# Altium schematic sheet channel.SchDoc
size A4
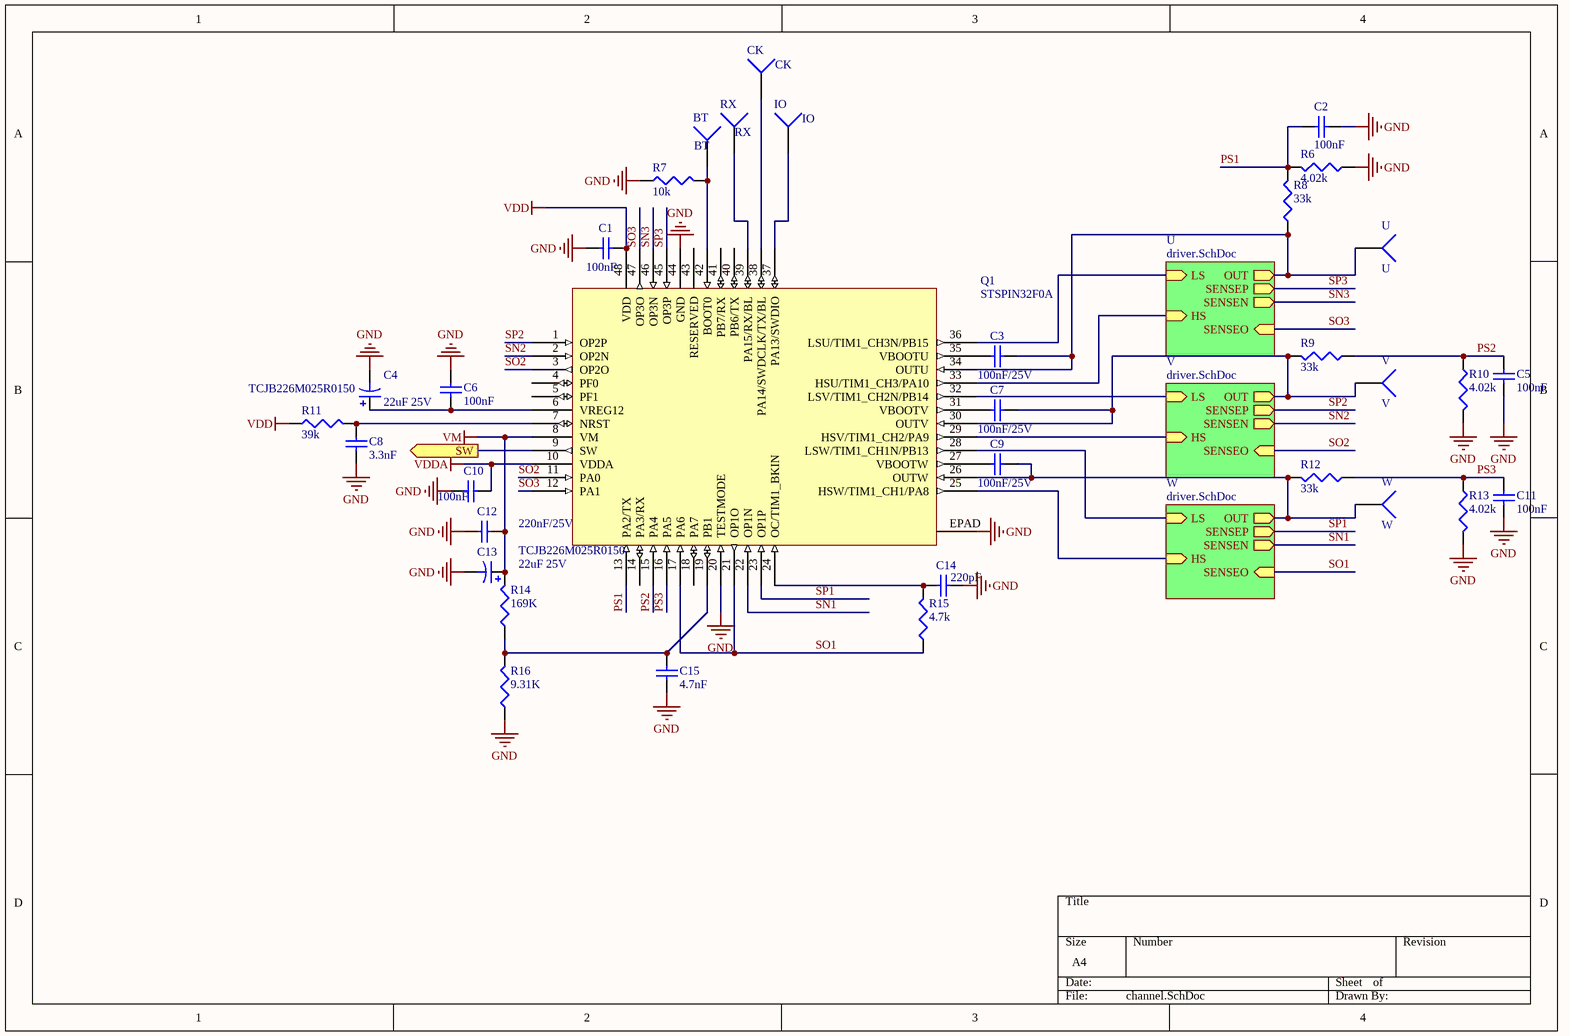
[diagram p0: channel.SchDoc]

## Parts
BT  BT  [solder_pin_small]
C1  100nF  [MY_0402]
C2  100nF  [MY_0402]
C3  100nF/25V  [MY_0402]
C4  TCJB226M025R0150  value 22uF 25V  [my_1210_pol]
C5  100nF  [MY_0402]
C6  100nF  [MY_0402]
C7  100nF/25V  [MY_0402]
C8  3.3nF  [MY_0402]
C9  100nF/25V  [MY_0402]
C10  100nF  [MY_0402]
C11  100nF  [MY_0402]
C12  220nF/25V  [MY_0402]
C13  TCJB226M025R0150  value 22uF 25V  [my_1210_pol]
C14  220pF  [MY_0402]
C15  4.7nF  [MY_0402]
CK  CK  [solder_pin_small]
IO  IO  [solder_pin_small]
Q1  STSPIN32F0A  [VFQFPN48]
R6  4.02k  [MY_0402]
R7  10k  [MY_0402]
R8  33k  [MY_0402]
R9  33k  [MY_0402]
R10  4.02k  [MY_0402]
R11  39k  [MY_0402]
R12  33k  [MY_0402]
R13  4.02k  [MY_0402]
R14  169K  [MY_0402]
R15  4.7k  [MY_0402]
R16  9.31K  [MY_0402]
RX  RX  [solder_pin_small]
U  U  [solder_pin_small]
V  V  [solder_pin_small]
W  W  [solder_pin_small]

## Sub-sheets
U = driver.SchDoc: LS (in), OUT (out), HS (in), SENSEP (out), SENSEN (out), SENSEO (in)
V = driver.SchDoc: LS (in), OUT (out), HS (in), SENSEP (out), SENSEN (out), SENSEO (in)
W = driver.SchDoc: LS (in), OUT (out), HS (in), SENSEP (out), SENSEN (out), SENSEO (in)

## Ports
SW (out)

## Nets
GND: C1.1 C2.2 C4.2 C5.1 C6.1 C8.2 C10.2 C11.1 C12.2 C13.2 C14.2 C15.2 Q1.20(TESTMODE) Q1.44(GND) Q1.EPAD R6.1 R7.1 R10.2 R13.2 R16.1
VDD: C1.2 Q1.48(VDD) R11.1
VDDA: C10.1 Q1.10(VDDA)
VM: C12.1 C13.1 Q1.8(VM) R14.2
PS1: C2.1 Q1.13(PA2/TX) R6.2 R8.2
PS2: C5.2 Q1.15(PA4) R9.1 R10.1
PS3: C11.2 Q1.16(PA5) R12.1 R13.1
SN1: Q1.22(OP1N) ; sheet W/SENSEN
SN2: Q1.2(OP2N) ; sheet V/SENSEN
SN3: Q1.46(OP3N) ; sheet U/SENSEN
SO1: Q1.17(PA6) Q1.21(OP1O) R15.1 ; sheet W/SENSEO
SO2: Q1.3(OP2O) Q1.11(PA0) ; sheet V/SENSEO
SO3: Q1.12(PA1) Q1.47(OP3O) ; sheet U/SENSEO
SP1: Q1.23(OP1P) ; sheet W/SENSEP
SP2: Q1.1(OP2P) ; sheet V/SENSEP
SP3: Q1.45(OP3P) ; sheet U/SENSEP
SW: Q1.9(SW) ; port SW
NetBT_1: BT.1 Q1.42(BOOT0) R7.2
NetC3_1: C3.1 Q1.35(VBOOTU)
NetC3_2: C3.2 Q1.34(OUTU) R8.1 U.1 ; sheet U/OUT
NetC4_1: C4.1 C6.2 Q1.6(VREG12)
NetC7_1: C7.1 Q1.31(VBOOTV)
NetC7_2: C7.2 Q1.30(OUTV) R9.2 V.1 ; sheet V/OUT
NetC8_1: C8.1 Q1.7(NRST) R11.2
NetC9_1: C9.1 Q1.27(VBOOTW)
NetC9_2: C9.2 Q1.26(OUTW) R12.2 W.1 ; sheet W/OUT
NetC14_1: C14.1 Q1.24(OC/TIM1_BKIN) R15.2
NetC15_1: C15.1 Q1.19(PB1) R14.1 R16.2
NetCK_1: CK.1 Q1.38(PA14/SWDCLK/TX/BL)
NetIO_1: IO.1 Q1.37(PA13/SWDIO)
NetQ1_25: Q1.25(HSW/TIM1_CH1/PA8) ; sheet W/HS
NetQ1_28: Q1.28(LSW/TIM1_CH1N/PB13) ; sheet W/LS
NetQ1_29: Q1.29(HSV/TIM1_CH2/PA9) ; sheet V/HS
NetQ1_32: Q1.32(LSV/TIM1_CH2N/PB14) ; sheet V/LS
NetQ1_33: Q1.33(HSU/TIM1_CH3/PA10) ; sheet U/HS
NetQ1_36: Q1.36(LSU/TIM1_CH3N/PB15) ; sheet U/LS
NetQ1_39: Q1.39(PA15/RX/BL) RX.1

Not connected (* = marked no-connect by the designer): Q1 4(PF0) 5(PF1) 14(PA3/RX) 18(PA7) 40(PB6/TX) 41(PB7/RX) 43(RESERVED)

## Library data of the parts
BT CK IO RX U V W = Socket: LatestRevisionDate: 17-Jul-2002; LatestRevisionNote: Re-released for DXP Platform.; Publisher: Altium Limited
C1 C6 C10 C15 = Cap: Capacitor; Published: 8-Jun-2000; LatestRevisionDate: 17-Jul-2002; LatestRevisionNote: Re-released for DXP Platform.; PackageReference: RAD-0.3; Publisher: Altium Limited; PackageDescription: Radial Cap, Thru-Hole; 2 Leads; 0.3 in Pin Spacing
  C1 C6 C10: Value: 100nF
  C15: Value: 4.7nF
C2 C5 C11 C14 = Cap: Capacitor; Value: 4.7nF; Published: 8-Jun-2000; LatestRevisionDate: 17-Jul-2002; LatestRevisionNote: Re-released for DXP Platform.; PackageReference: RAD-0.3; Publisher: Altium Limited; PackageDescription: Radial Cap, Thru-Hole; 2 Leads; 0.3 in Pin Spacing
C3 C7-C9 C12 = Cap: Capacitor; Value: 100nF; Published: 8-Jun-2000; LatestRevisionDate: 17-Jul-2002; LatestRevisionNote: Re-released for DXP Platform.; PackageReference: RAD-0.3; Publisher: Altium Limited; PackageDescription: Radial Cap, Thru-Hole; 2 Leads; 0.3 in Pin Spacing
C4 C13 = Cap Pol3: Polarized Capacitor (Surface Mount); Published: 8-Jun-2000; LatestRevisionDate: 29-May-2009; LatestRevisionNote: IPC-7351 Footprint Added.; PackageReference: C0805; Publisher: Altium Limited; PackageDescription: Chip Capacitor
R6 R8-R16 = Res3: Resistor; Value: 10K; Published: 8-Jun-2000; LatestRevisionDate: 29-May-2009; LatestRevisionNote: IPC-7351 Footprint Added.; PackageReference: J1-0603; Publisher: Altium Limited; PackageDescription: Chip Resistor
R7 = Res3: Resistor; Published: 8-Jun-2000; LatestRevisionDate: 29-May-2009; LatestRevisionNote: IPC-7351 Footprint Added.; PackageReference: J1-0603; Publisher: Altium Limited; PackageDescription: Chip Resistor; Value: 10K